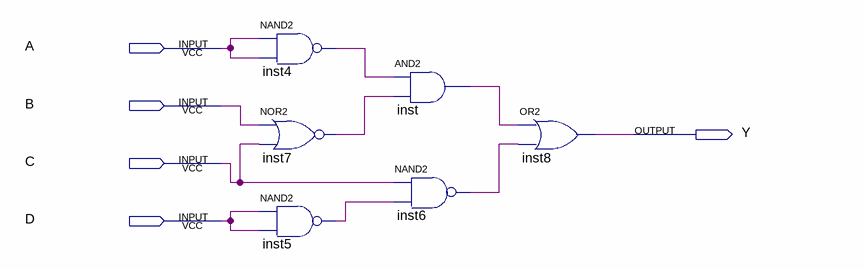
[diagram p0: schematic sheet]
// Quartus schematic design1_gudmundsson.bdf as structural Verilog: 6 symbols, 5 pins
module design1_gudmundsson (
  input  A,
  input  B,
  input  C,
  input  D,
  output Y
);

  wire inst4_out, inst5_out, inst6_out, inst7_out, inst_out;

  nand inst4 (inst4_out, A, A);
  nor inst7 (inst7_out, B, C);
  nand inst5 (inst5_out, D, D);
  and inst (inst_out, inst4_out, inst7_out);
  nand inst6 (inst6_out, C, inst5_out);
  or inst8 (Y, inst_out, inst6_out);
endmodule
